# EAGLE design Servo_2016 (EAGLE 7.3.0)

## Sheet 1 of 4
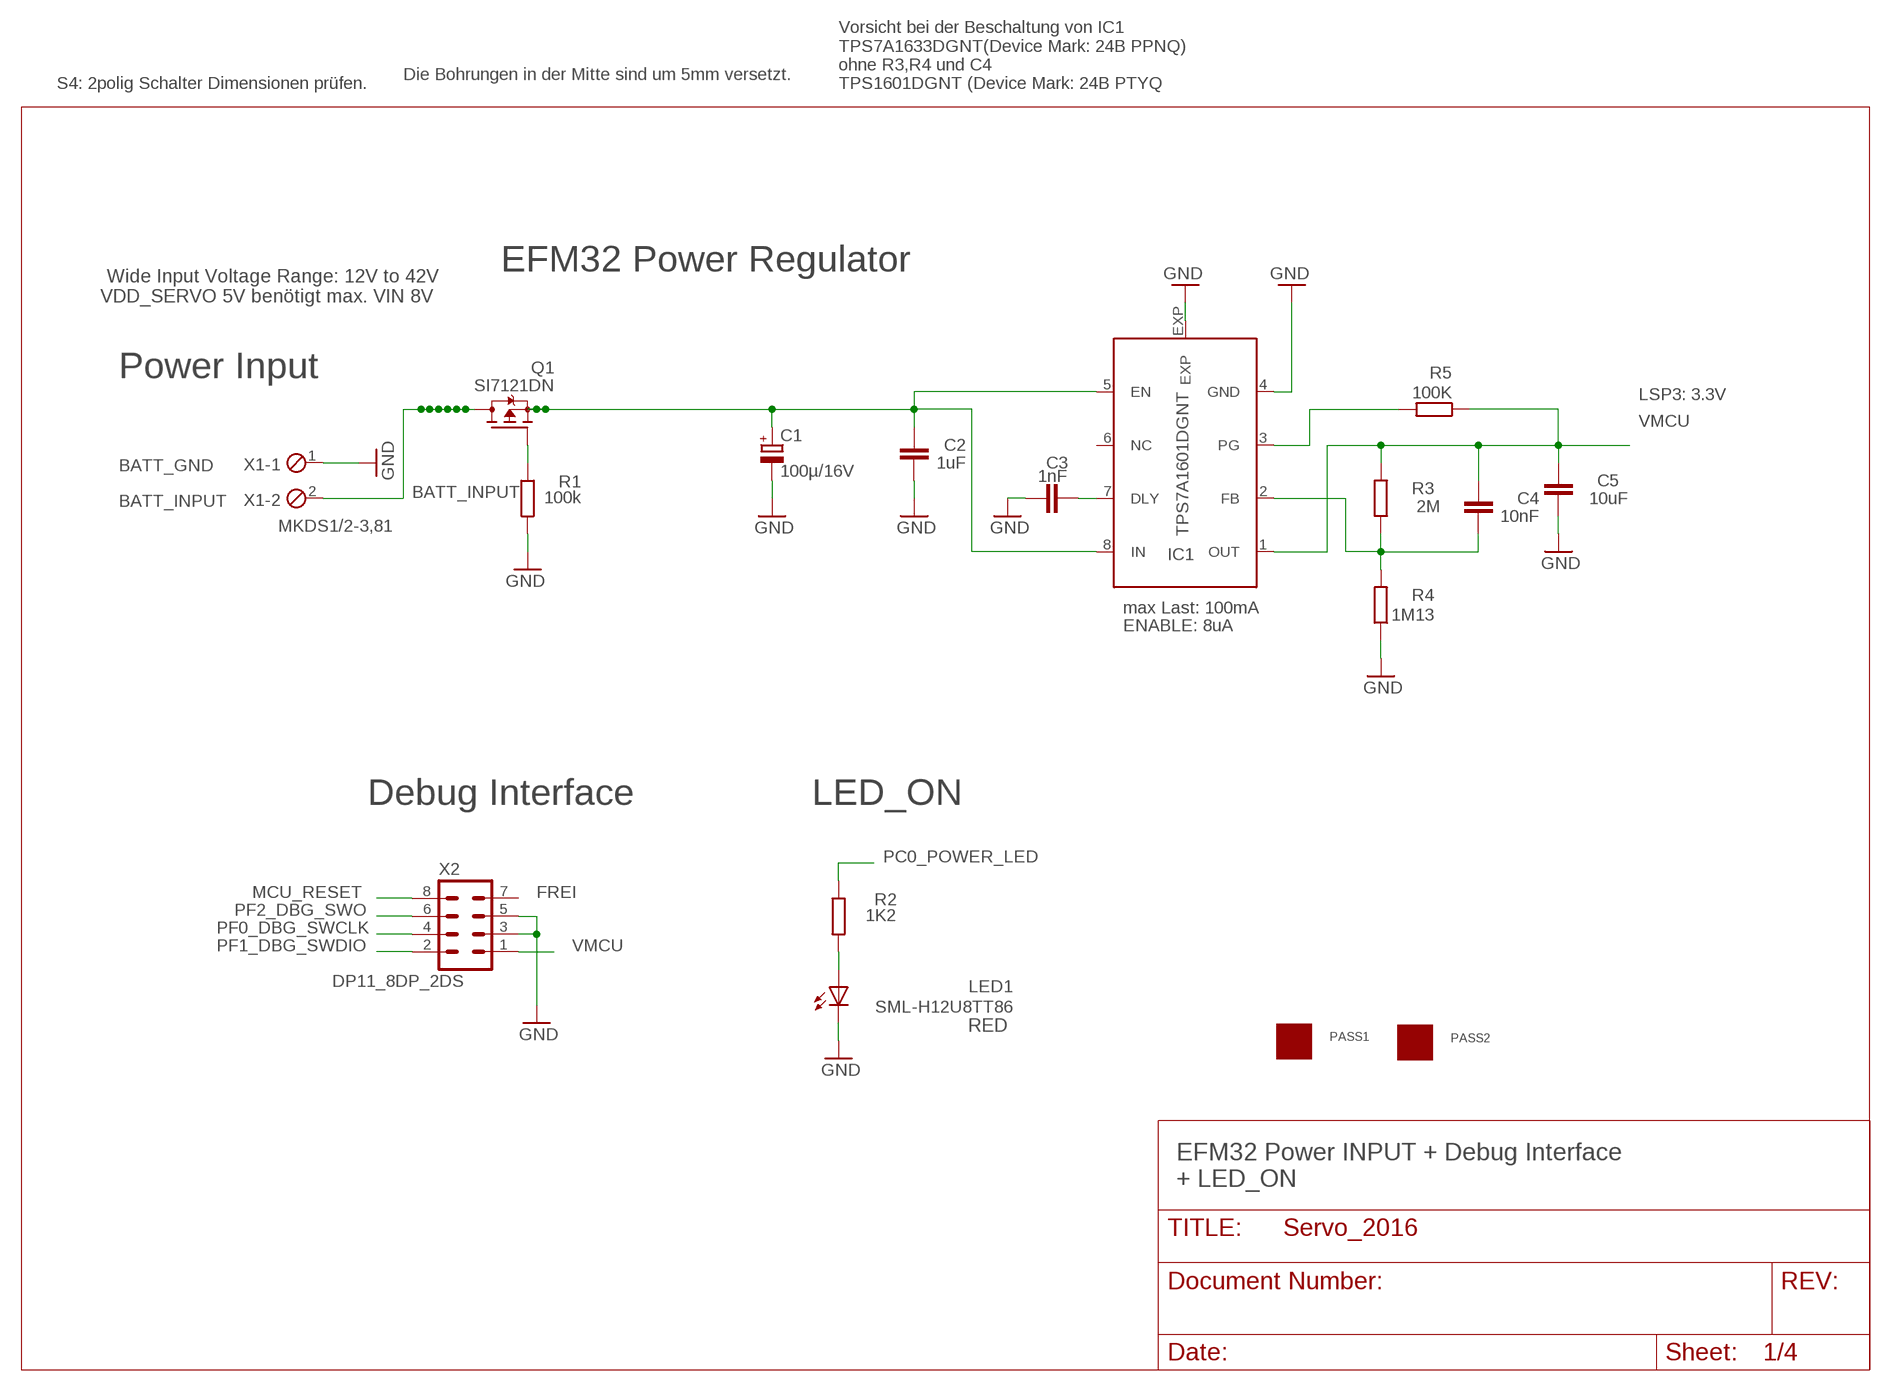
[diagram p0: schematic, sheet 1]

### Parts
C1  100µ/16V  CPOL-EUE  [PANASONIC_E]
C2  1uF  C-EUC0603  [C0603]
C3  1nF  C-EUC0603  [C0603]
C4  10nF  C-EUC0603  [C0603]
C5  10uF  C-EUC1206  [C1206]
IC1  TPS7A1601DGNT  TPS7A16  [DGN_S-PDSO-G8-EXP]
LED1  SML-H12U8TT86  LEDCHIPLED_0805  [CHIPLED_0805]
PASS1  ROUND_1MM1.5  [ROUND2_1.5MM]
PASS2  ROUND_1MM1.5  [ROUND2_1.5MM]
Q1  SI7121DN  TRANSISTOR-FET_SI7113DN  [TRANSISTOR-FET_1212-8S]
R1  100k  R-EU_R0805  [R0805]
R2  1K2  R-EU_R0805  [R0805]
R3  2M  R-EU_R0805  [R0805]
R4  1M13  R-EU_R0805  [R0805]
R5  100K  R-EU_R0805  [R0805]
X1  MKDS1/2-3,81  [2POL381]
X2  DP11_8DP_2DS  [DP11_8DP-2DS]

### Nets
BATT_INPUT: Q1.5(D) Q1.6(D) Q1.7(D) Q1.8(D) Q1.9(D) Q1.10(D) Q1.11(D) X1.2 ; also sheet 3
GND: C1.- C2.1 C3.1 C5.1 IC1.4(GND) IC1.EXP LED1.C R1.1 R4.1 X1.1 X2.3 X2.5 ; also sheet 2,3,4
MCU_RESET: X2.8 ; also sheet 2
N$4: C1.+ C2.2 IC1.5(EN) IC1.8(IN) Q1.1(S) Q1.2(S) Q1.3(S)
N$5: C3.2 IC1.7(DLY)
N$8: C4.1 IC1.2(FB) R3.1 R4.2
N$9: IC1.3(PG) R5.2
N$20: Q1.4(G) R1.2
N$29: LED1.A R2.2
PC0_POWER_LED: R2.1 ; also sheet 2
PF0_DBG_SWCLK: X2.4 ; also sheet 2
PF1_DBG_SWDIO: X2.2 ; also sheet 2
PF2_DBG_SWO: X2.6 ; also sheet 2
VMCU: C4.2 C5.2 IC1.1(OUT) R3.2 R5.1 X2.1 ; also sheet 2,4
Unconnected: IC1.6(NC) X2.7

### Notes on the sheet
- Die Bohrungen in der Mitte sind um 5mm versetzt.
- S4: 2polig Schalter Dimensionen prüfen.
- Vorsicht bei der Beschaltung von IC1 
  TPS7A1633DGNT(Device Mark: 24B PPNQ)
  ohne R3,R4 und C4
  TPS1601DGNT (Device Mark: 24B PTYQ
- EFM32 Power Regulator
- Wide Input Voltage Range: 12V to 42V
  VDD_SERVO 5V benötigt max. VIN 8V
- Power Input
- LSP3: 3.3V
- BATT_GND
- BATT_INPUT
- max Last: 100mA
- ENABLE: 8uA
- Debug Interface | LED_ON
- FREI
- RED
- EFM32 Power INPUT + Debug Interface
  + LED_ON

## Sheet 2 of 4
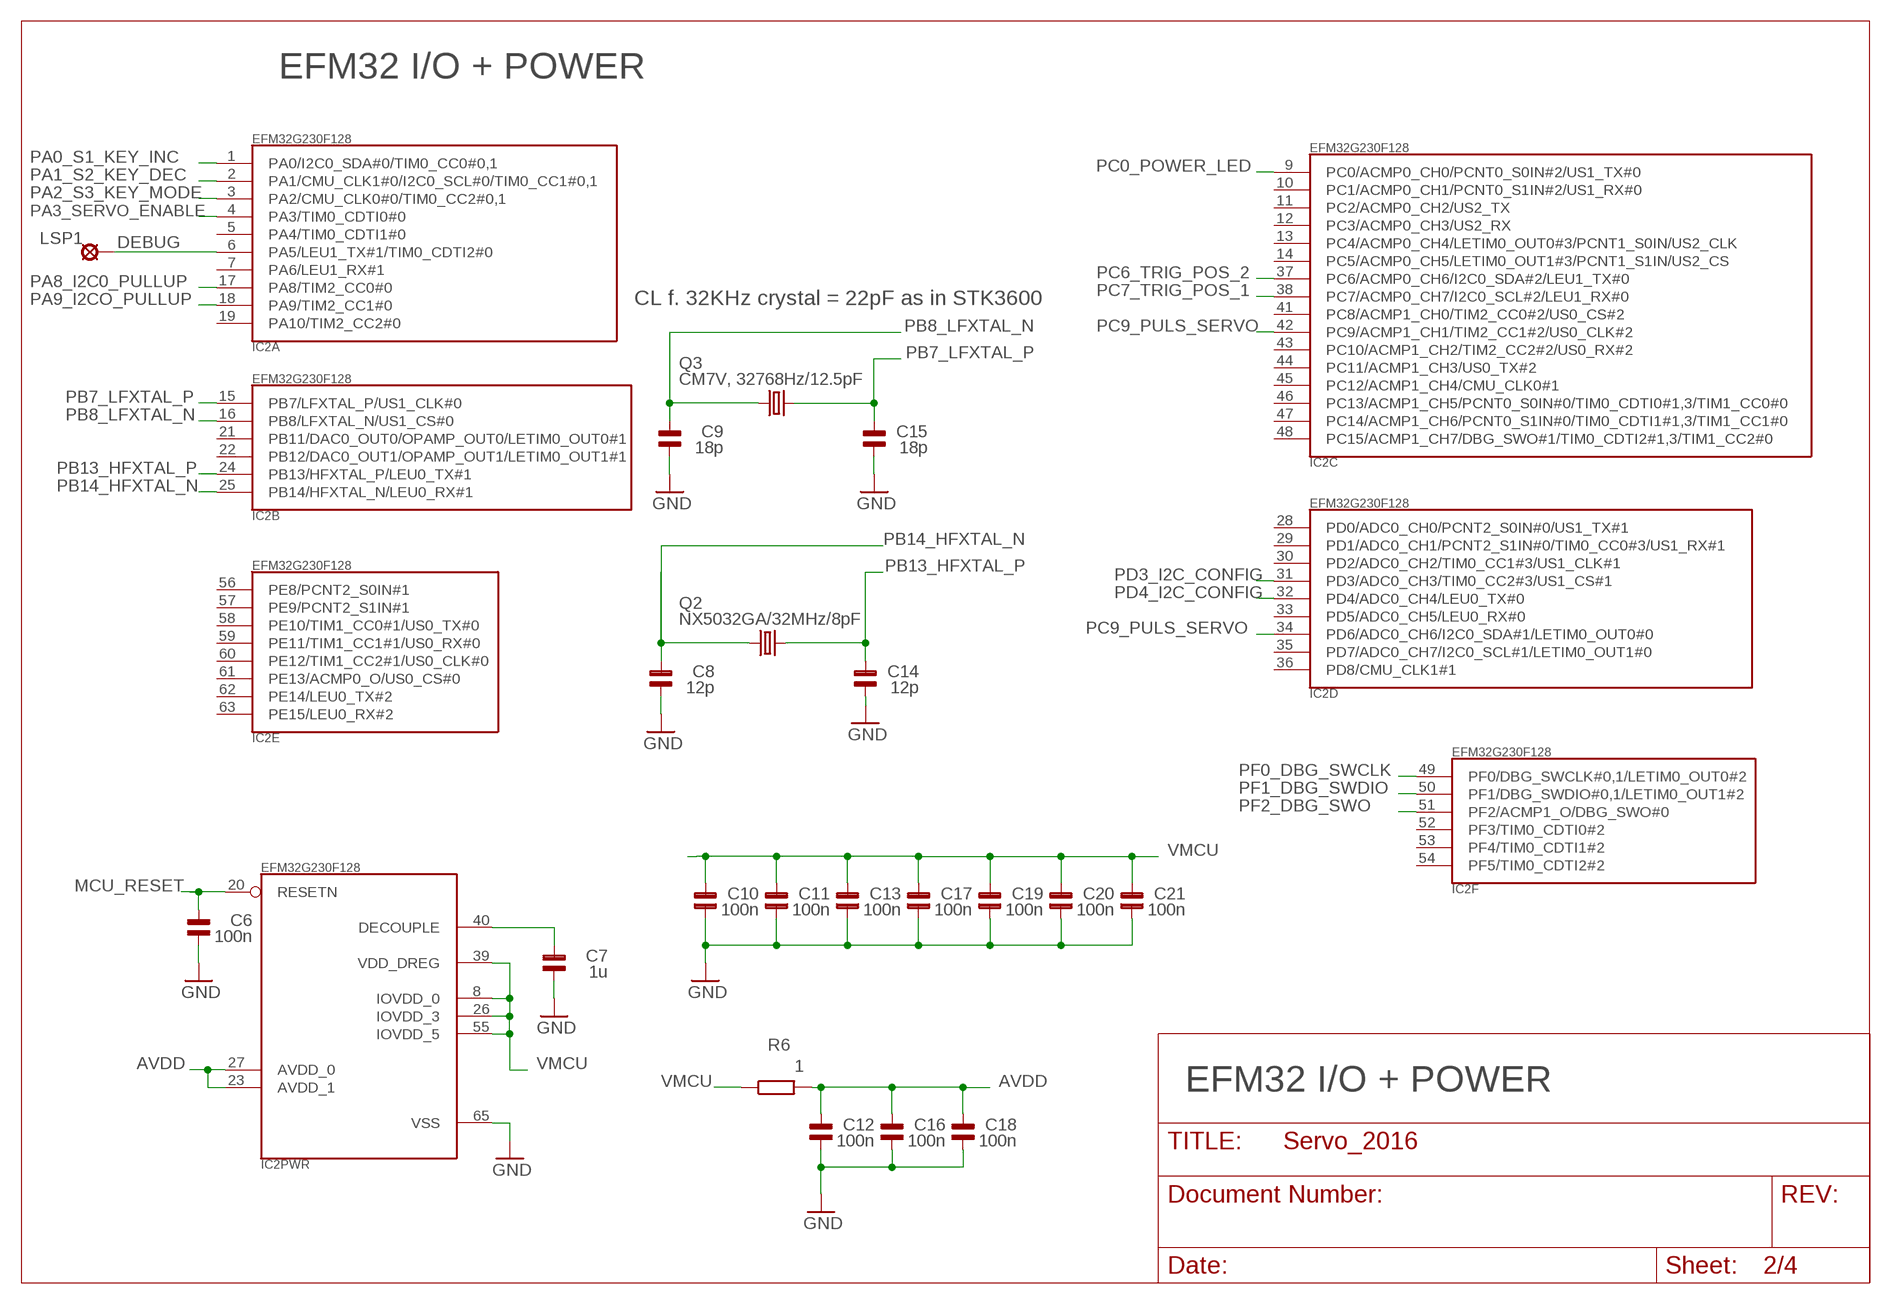
[diagram p1: schematic, sheet 2]

### Parts
C6  100n  C_SMD0805  [0805]
C7  1u  C_SMD0805  [0805]
C8  12p  C_SMD0805  [0805]
C9  18p  C_SMD0805  [0805]
C10  100n  C_SMD0805  [0805]
C11  100n  C_SMD0805  [0805]
C12  100n  C_SMD0805  [0805]
C13  100n  C_SMD0805  [0805]
C14  12p  C_SMD0805  [0805]
C15  18p  C_SMD0805  [0805]
C16  100n  C_SMD0805  [0805]
C17  100n  C_SMD0805  [0805]
C18  100n  C_SMD0805  [0805]
C19  100n  C_SMD0805  [0805]
C20  100n  C_SMD0805  [0805]
C21  100n  C_SMD0805  [0805]
IC2  EFM32G230F128  [QFN64]
LSP1  (n.b.)LSP10  LSP10  [LSP10]
Q2  NX5032GA/32MHz/8pF  CRYSTAL2P5.0X3.2  [CRYSTAL2P5.0X3.2]
Q3  CM7V, 32768Hz/12.5pF  CRYSTAL2P  [CRYSTAL2P3.2X1.5]
R6  1  R-EU_R0805  [R0805]

### Nets
AVDD [VCC]: C12.2 C16.2 C18.2 IC2.23(PWR:AVDD_1) IC2.27(PWR:AVDD_0) R6.2
DEBUG: IC2.6(A:PA5/LEU1_TX#1/TIM0_CDTI2#0) LSP1.MP
GND: C6.1 C7.1 C8.1 C9.1 C10.1 C11.1 C12.1 C13.1 C14.1 C15.1 C16.1 C17.1 C18.1 C19.1 C20.1 C21.1 IC2.65(PWR:VSS) ; also sheet 1,3,4
MCU_RESET: C6.2 IC2.20(PWR:RESETN) ; also sheet 1
N$30: C7.2 IC2.40(PWR:DECOUPLE)
PA0_S1_KEY_INC: IC2.1(A:PA0/I2C0_SDA#0/TIM0_CC0#0,1) ; also sheet 4
PA1_S2_KEY_DEC: IC2.2(A:PA1/CMU_CLK1#0/I2C0_SCL#0/TIM0_CC1#0,1) ; also sheet 4
PA2_S3_KEY_MODE: IC2.3(A:PA2/CMU_CLK0#0/TIM0_CC2#0,1) ; also sheet 4
PA3_SERVO_ENABLE: IC2.4(A:PA3/TIM0_CDTI0#0) ; also sheet 3
PA8_I2C0_PULLUP: IC2.17(A:PA8/TIM2_CC0#0) ; also sheet 4
PA9_I2CO_PULLUP: IC2.18(A:PA9/TIM2_CC1#0) ; also sheet 4
PB7_LFXTAL_P: C15.2 IC2.15(B:PB7/LFXTAL_P/US1_CLK#0) Q3.2
PB8_LFXTAL_N: C9.2 IC2.16(B:PB8/LFXTAL_N/US1_CS#0) Q3.1
PB13_HFXTAL_P: C14.2 IC2.24(B:PB13/HFXTAL_P/LEU0_TX#1) Q2.2
PB14_HFXTAL_N: C8.2 IC2.25(B:PB14/HFXTAL_N/LEU0_RX#1) Q2.1
PC0_POWER_LED: IC2.9(C:PC0/ACMP0_CH0/PCNT0_S0IN#2/US1_TX#0) ; also sheet 1
PC6_TRIG_POS_2: IC2.37(C:PC6/ACMP0_CH6/I2C0_SDA#2/LEU1_TX#0) ; also sheet 4
PC7_TRIG_POS_1: IC2.38(C:PC7/ACMP0_CH7/I2C0_SCL#2/LEU1_RX#0) ; also sheet 4
PC9_PULS_SERVO: IC2.34(D:PD6/ADC0_CH6/I2C0_SDA#1/LETIM0_OUT0#0) IC2.42(C:PC9/ACMP1_CH1/TIM2_CC1#2/US0_CLK#2) ; also sheet 4
PD3_I2C_CONFIG: IC2.31(D:PD3/ADC0_CH3/TIM0_CC2#3/US1_CS#1) ; also sheet 4
PD4_I2C_CONFIG: IC2.32(D:PD4/ADC0_CH4/LEU0_TX#0) ; also sheet 4
PF0_DBG_SWCLK: IC2.49(F:PF0/DBG_SWCLK#0,1/LETIM0_OUT0#2) ; also sheet 1
PF1_DBG_SWDIO: IC2.50(F:PF1/DBG_SWDIO#0,1/LETIM0_OUT1#2) ; also sheet 1
PF2_DBG_SWO: IC2.51(F:PF2/ACMP1_O/DBG_SWO#0) ; also sheet 1
VMCU: C10.2 C11.2 C13.2 C17.2 C19.2 C20.2 C21.2 IC2.8(PWR:IOVDD_0) IC2.26(PWR:IOVDD_3) IC2.39(PWR:VDD_DREG) IC2.55(PWR:IOVDD_5) R6.1 ; also sheet 1,4
Unconnected: IC2.5(A:PA4/TIM0_CDTI1#0) IC2.7(A:PA6/LEU1_RX#1) IC2.10(C:PC1/ACMP0_CH1/PCNT0_S1IN#2/US1_RX#0) IC2.11(C:PC2/ACMP0_CH2/US2_TX) IC2.12(C:PC3/ACMP0_CH3/US2_RX) IC2.13(C:PC4/ACMP0_CH4/LETIM0_OUT0#3/PCNT1_S0IN/US2_CLK) IC2.14(C:PC5/ACMP0_CH5/LETIM0_OUT1#3/PCNT1_S1IN/US2_CS) IC2.19(A:PA10/TIM2_CC2#0) IC2.21(B:PB11/DAC0_OUT0/OPAMP_OUT0/LETIM0_OUT0#1) IC2.22(B:PB12/DAC0_OUT1/OPAMP_OUT1/LETIM0_OUT1#1) IC2.28(D:PD0/ADC0_CH0/PCNT2_S0IN#0/US1_TX#1) IC2.29(D:PD1/ADC0_CH1/PCNT2_S1IN#0/TIM0_CC0#3/US1_RX#1) IC2.30(D:PD2/ADC0_CH2/TIM0_CC1#3/US1_CLK#1) IC2.33(D:PD5/ADC0_CH5/LEU0_RX#0) IC2.35(D:PD7/ADC0_CH7/I2C0_SCL#1/LETIM0_OUT1#0) IC2.36(D:PD8/CMU_CLK1#1) IC2.41(C:PC8/ACMP1_CH0/TIM2_CC0#2/US0_CS#2) IC2.43(C:PC10/ACMP1_CH2/TIM2_CC2#2/US0_RX#2) IC2.44(C:PC11/ACMP1_CH3/US0_TX#2) IC2.45(C:PC12/ACMP1_CH4/CMU_CLK0#1) IC2.46(C:PC13/ACMP1_CH5/PCNT0_S0IN#0/TIM0_CDTI0#1,3/TIM1_CC0#0) IC2.47(C:PC14/ACMP1_CH6/PCNT0_S1IN#0/TIM0_CDTI1#1,3/TIM1_CC1#0) IC2.48(C:PC15/ACMP1_CH7/DBG_SWO#1/TIM0_CDTI2#1,3/TIM1_CC2#0) IC2.52(F:PF3/TIM0_CDTI0#2) IC2.53(F:PF4/TIM0_CDTI1#2) IC2.54(F:PF5/TIM0_CDTI2#2) IC2.56(E:PE8/PCNT2_S0IN#1) IC2.57(E:PE9/PCNT2_S1IN#1) IC2.58(E:PE10/TIM1_CC0#1/US0_TX#0) IC2.59(E:PE11/TIM1_CC1#1/US0_RX#0) IC2.60(E:PE12/TIM1_CC2#1/US0_CLK#0) IC2.61(E:PE13/ACMP0_O/US0_CS#0) IC2.62(E:PE14/LEU0_TX#2) IC2.63(E:PE15/LEU0_RX#2)

### Notes on the sheet
- EFM32 I/O + POWER
- CL f. 32KHz crystal = 22pF as in STK3600
- EFM32 I/O + POWER

## Sheet 3 of 4
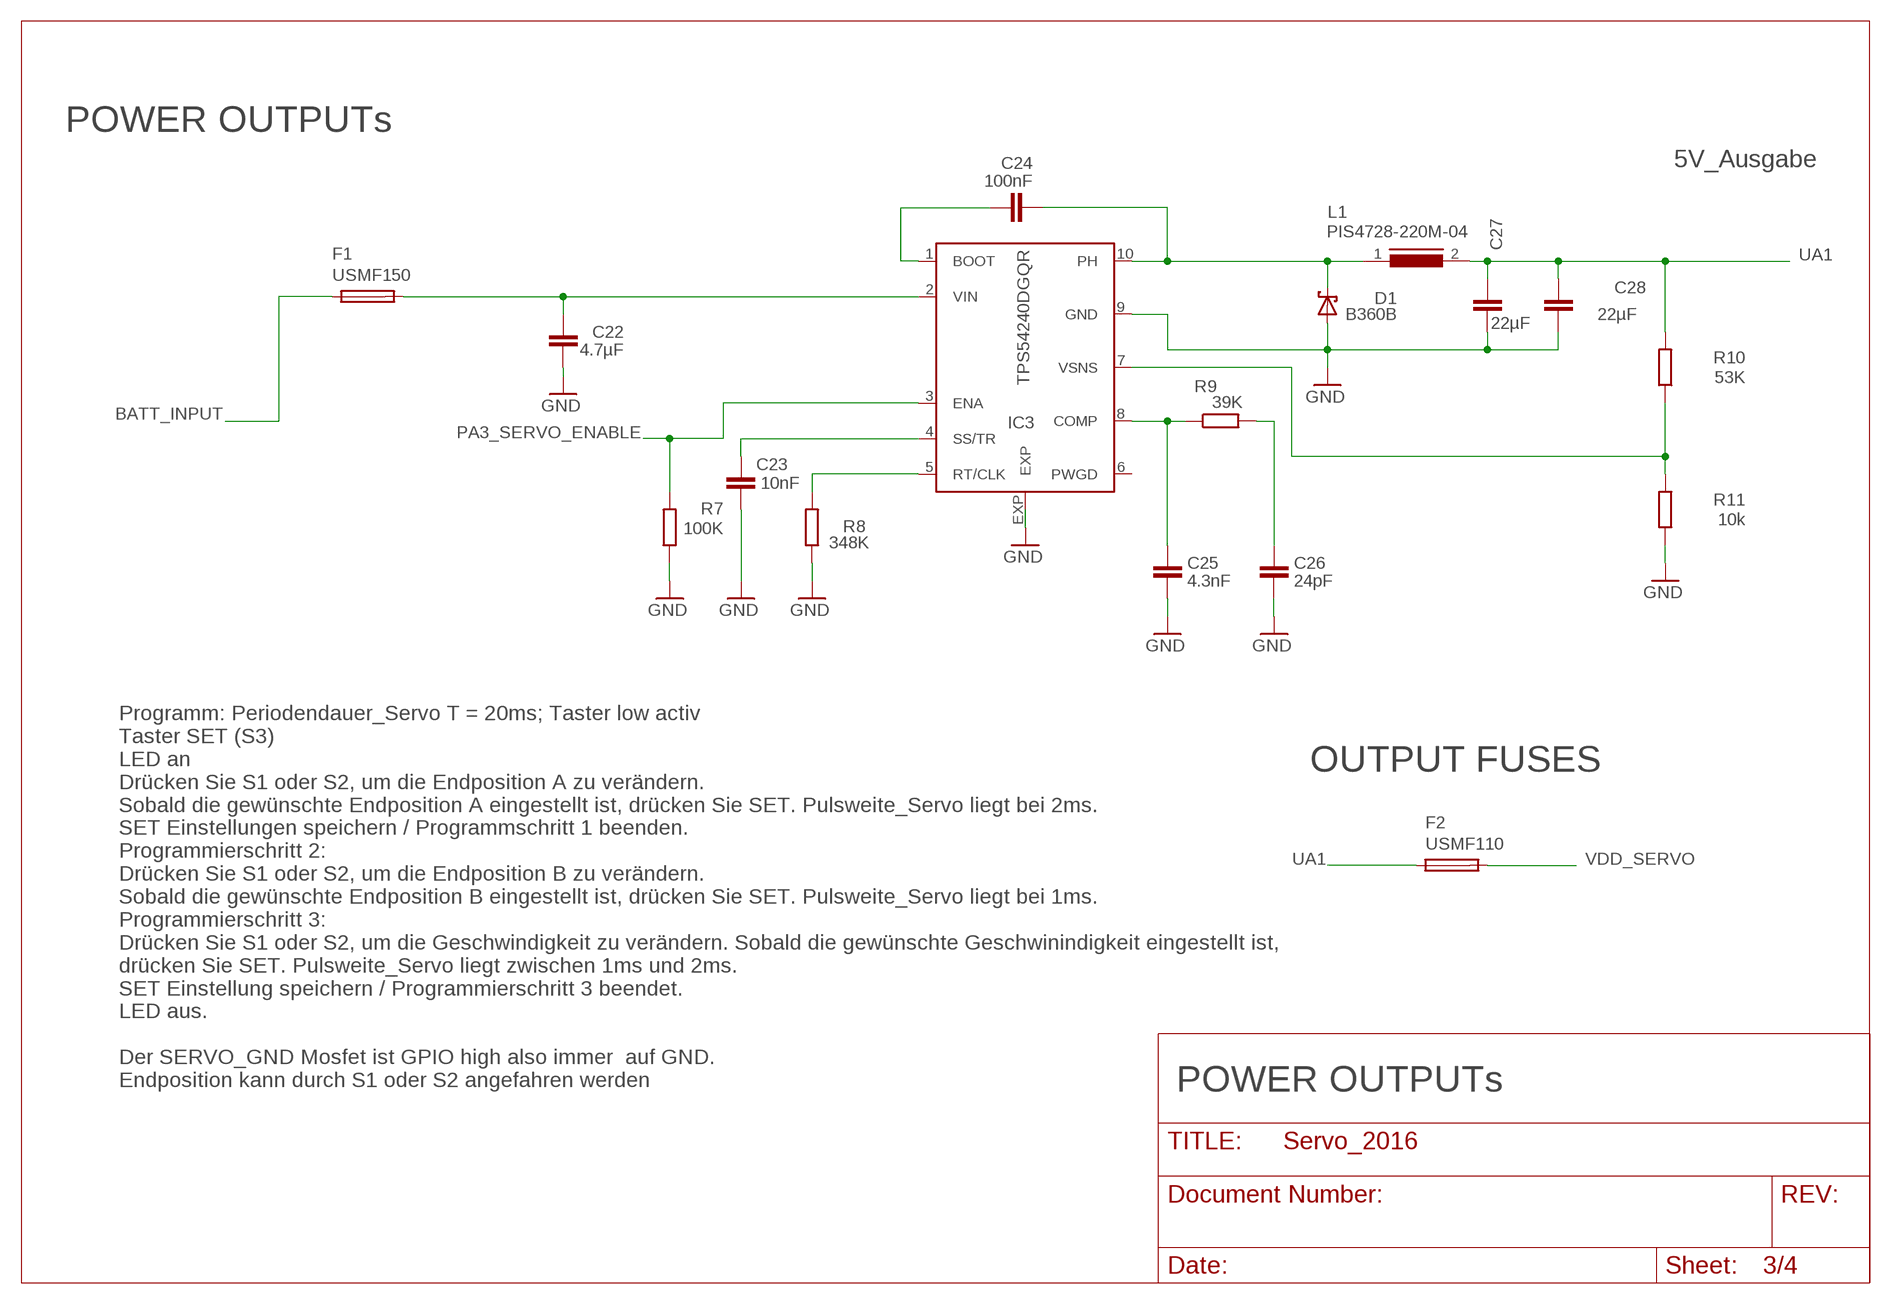
[diagram p2: schematic, sheet 3]

### Parts
C22  4.7µF  C-EUC1210  [C1210]
C23  10nF  C-EUC0603  [C0603]
C24  100nF  C-EUC0603  [C0603]
C25  4.3nF  C-EUC0603  [C0603]
C26  24pF  C-EUC0603  [C0603]
C27  22µF  C-EUC1210  [C1210]
C28  22µF  C-EUC1210  [C1210]
D1  B360B  SCHOTTKY-DIODESMD  [SMB]
F1  USMF150  PFUF  [PFUF_1210POLY]
F2  USMF110  PFUF  [PFUF_1210POLY]
IC3  TPS54240DGQR  [S-PDSO-G10]
L1  PIS4728-220M-04  DR127  [DR127]
R7  100K  R-EU_R0805  [R0805]
R8  348K  R-EU_R0805  [R0805]
R9  39K  R-EU_R0805  [R0805]
R10  53K  R-EU_R0805  [R0805]
R11  10k  R-EU_R0805  [R0805]

### Nets
BATT_INPUT: F1.P$1 ; also sheet 1
GND: C22.2 C23.2 C25.2 C26.2 C27.2 C28.2 D1.A IC3.9(GND) IC3.EXP R7.1 R8.1 R11.1 ; also sheet 1,2,4
N$1: IC3.5(RT/CLK) R8.2
N$19: C24.2 IC3.1(BOOT)
N$26: C24.1 D1.C IC3.10(PH) L1.1
N$27: C23.1 IC3.4(SS/TR)
N$28: C25.1 IC3.8(COMP) R9.1
N$31: C26.1 R9.2
N$32: IC3.7(VSNS) R10.1 R11.2
N$71: C22.1 F1.P$2 IC3.2(VIN)
PA3_SERVO_ENABLE: IC3.3(ENA) R7.2 ; also sheet 2
UA1: C27.1 C28.1 F2.P$1 L1.2 R10.2
VDD_SERVO: F2.P$2 ; also sheet 4
Unconnected: IC3.6(PWGD)

### Notes on the sheet
- POWER OUTPUTs
- 5V_Ausgabe
- OUTPUT FUSES
- Programm: Periodendauer_Servo T = 20ms; Taster low activ
  Taster SET (S3)
  LED an
  Drücken Sie S1 oder S2, um die Endposition A zu verändern.
  Sobald die gewünschte Endposition A eingestellt ist, drücken Sie SET. Pulsweite_Servo liegt bei 2ms.
  SET Einstellungen speichern / Programmschritt 1 beenden.
  Programmierschritt 2:
  Drücken Sie S1 oder S2, um die Endposition B zu verändern.
  Sobald die gewünschte Endposition B eingestellt ist, drücken Sie SET. Pulsweite_Servo liegt bei 1ms. 
  Programmierschritt 3:
  Drücken Sie S1 oder S2, um die Geschwindigkeit zu verändern. Sobald die gewünschte Geschwinindigkeit eingestellt ist,
  drücken Sie SET. Pulsweite_Servo liegt zwischen 1ms und 2ms.
  SET Einstellung speichern / Programmierschritt 3 beendet.
  LED aus. 
  
  Der SERVO_GND Mosfet ist GPIO high also immer  auf GND.
  Endposition kann durch S1 oder S2 angefahren werden
- POWER OUTPUTs

## Sheet 4 of 4
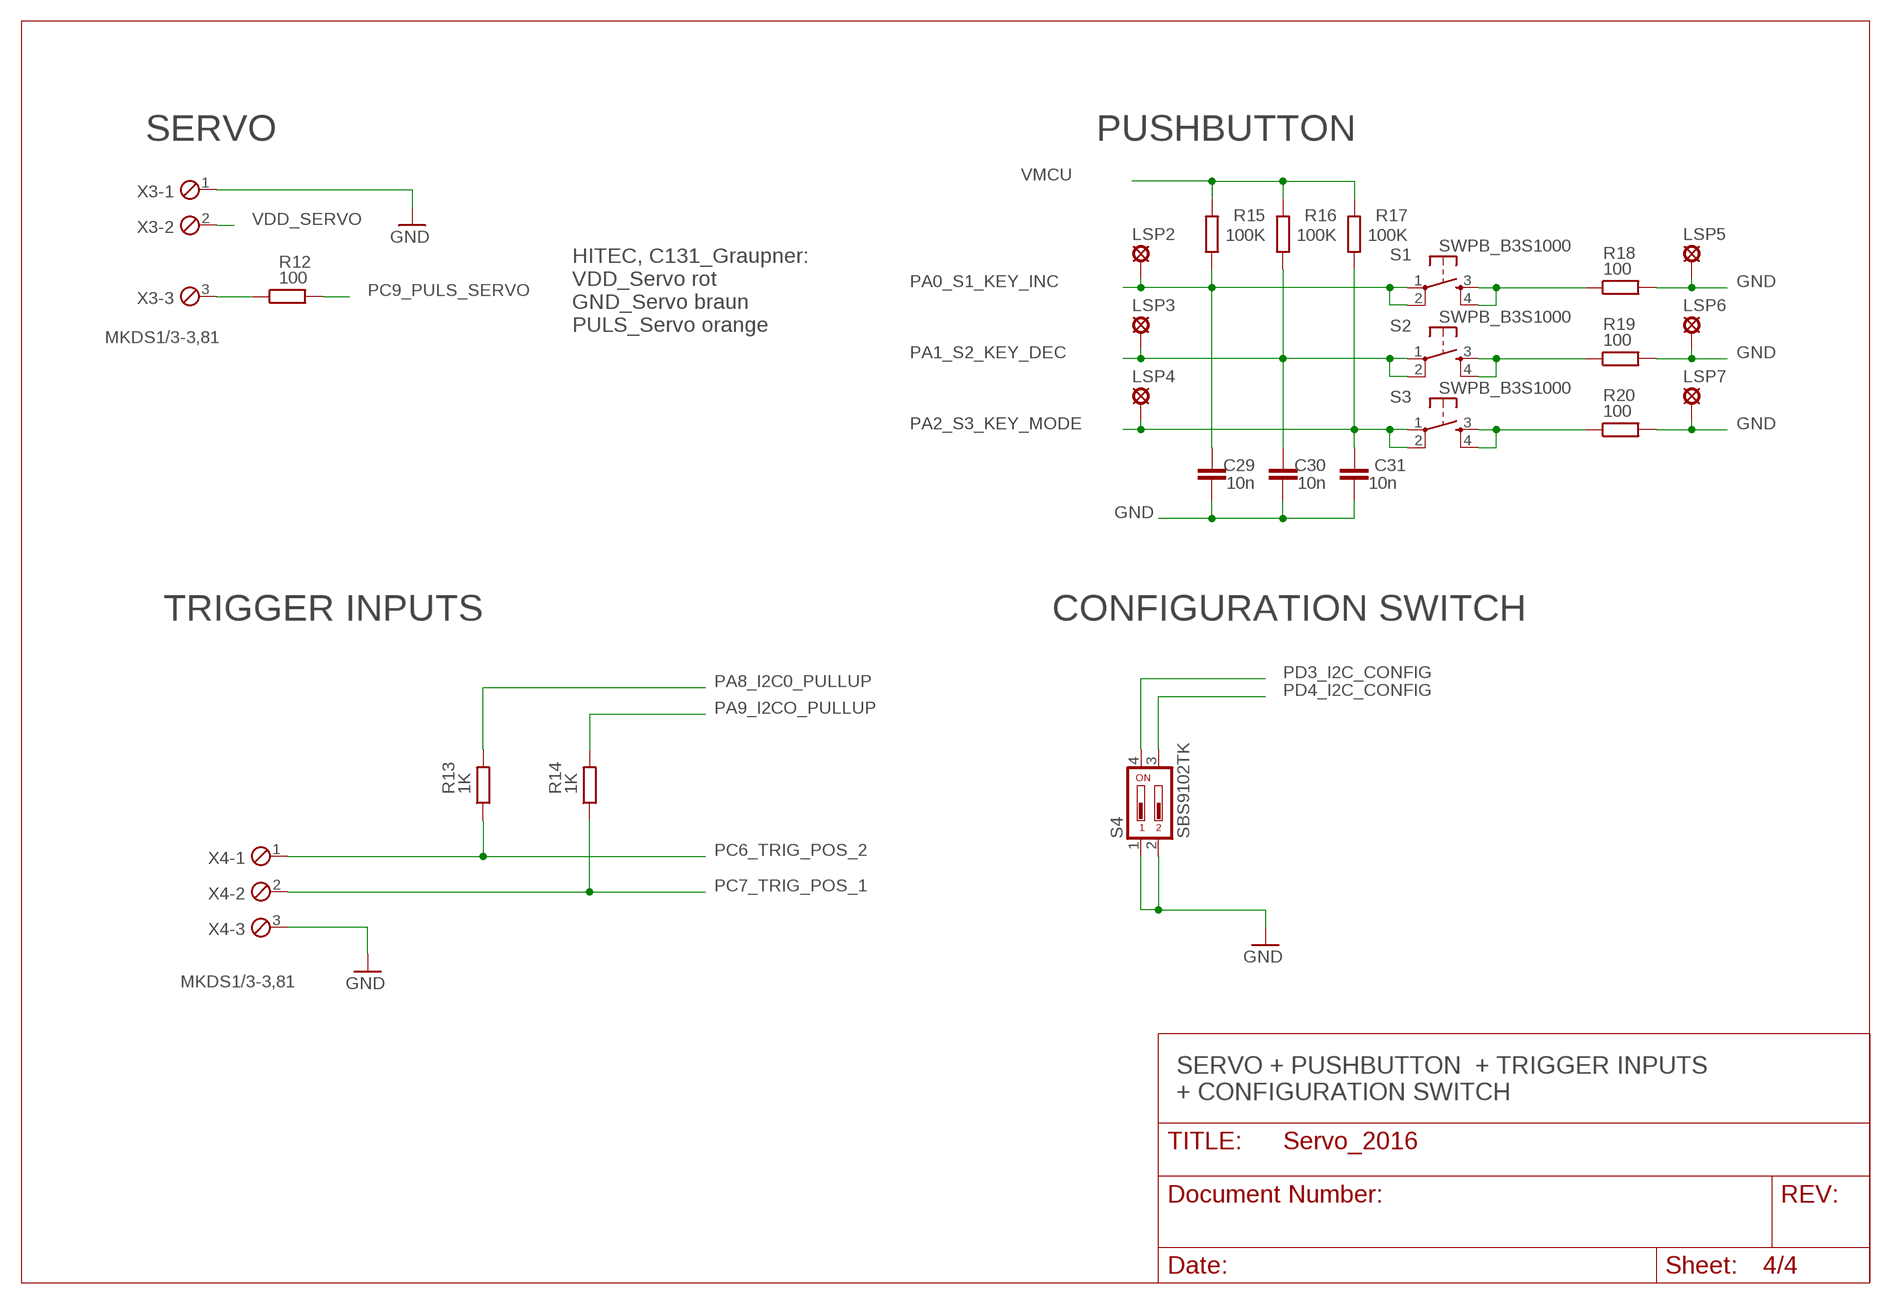
[diagram p3: schematic, sheet 4]

### Parts
C29  10n  C-EUC0603  [C0603]
C30  10n  C-EUC0603  [C0603]
C31  10n  C-EUC0603  [C0603]
LSP2  (n.b.)LSP10  LSP10  [LSP10]
LSP3  (n.b.)LSP10  LSP10  [LSP10]
LSP4  (n.b.)LSP10  LSP10  [LSP10]
LSP5  (n.b.)LSP10  LSP10  [LSP10]
LSP6  (n.b.)LSP10  LSP10  [LSP10]
LSP7  (n.b.)LSP10  LSP10  [LSP10]
R12  100  R-EU_R0805  [R0805]
R13  1K  R-EU_R0805  [R0805]
R14  1K  R-EU_R0805  [R0805]
R15  100K  R-EU_R0805  [R0805]
R16  100K  R-EU_R0805  [R0805]
R17  100K  R-EU_R0805  [R0805]
R18  100  R-EU_R0805  [R0805]
R19  100  R-EU_R0805  [R0805]
R20  100  R-EU_R0805  [R0805]
S1  SWPB_B3S1000  DTSM-6  [DTSM-6]
S2  SWPB_B3S1000  DTSM-6  [DTSM-6]
S3  SWPB_B3S1000  DTSM-6  [DTSM-6]
S4  SBS9102TK  219-02  [CTS-219-02]
X3  MKDS1/3-3,81  [3POL381]
X4  MKDS1/3-3,81  [3POL381]

### Nets
GND: C29.1 C30.1 C31.1 LSP5.MP LSP6.MP LSP7.MP R18.2 R19.2 R20.2 S4.1 S4.2 X3.1 X4.3 ; also sheet 1,2,3
N$10: R12.1 X3.3
N$15: R20.1 S3.3 S3.4
N$23: R18.1 S1.3 S1.4
N$24: R19.1 S2.3 S2.4
PA0_S1_KEY_INC: C29.2 LSP2.MP R15.1 S1.1 S1.2 ; also sheet 2
PA1_S2_KEY_DEC: C30.2 LSP3.MP R16.1 S2.1 S2.2 ; also sheet 2
PA2_S3_KEY_MODE: C31.2 LSP4.MP R17.1 S3.1 S3.2 ; also sheet 2
PA8_I2C0_PULLUP: R13.2 ; also sheet 2
PA9_I2CO_PULLUP: R14.2 ; also sheet 2
PC6_TRIG_POS_2: R13.1 X4.1 ; also sheet 2
PC7_TRIG_POS_1: R14.1 X4.2 ; also sheet 2
PC9_PULS_SERVO: R12.2 ; also sheet 2
PD3_I2C_CONFIG: S4.4 ; also sheet 2
PD4_I2C_CONFIG: S4.3 ; also sheet 2
VDD_SERVO: X3.2 ; also sheet 3
VMCU: R15.2 R16.2 R17.2 ; also sheet 1,2

### Notes on the sheet
- SERVO | PUSHBUTTON
- HITEC, C131_Graupner:
  VDD_Servo rot
  GND_Servo braun
  PULS_Servo orange
- TRIGGER INPUTS | CONFIGURATION SWITCH
- SERVO + PUSHBUTTON  + TRIGGER INPUTS
  + CONFIGURATION SWITCH

## Library data of the parts
C1 = rcl:CPOL-EU: POLARIZED CAPACITOR, European symbol
C2-C5 C29-C31 = resistor:C-EU: CAPACITOR, European symbol
C6-C21 = IAR.RLC:C_SMD
C22-C28 = rcl:C-EU: CAPACITOR, European symbol
D1 = diode:SCHOTTKY-DIODE: Schottky Diode
F1 F2 = fuse:PFUF
IC1 = texas_Kiermaier:TPS7A16
IC2 = EnergyMicro:EFM32G230F128: EFM32G230F128 Gecko Microcontroller in 9mm x 9mm QFN64 package
IC3 = texas:TPS54240DGQR
L1 = inductors:DR127: High Power Density, High Efficiency, Shielded Inductors Source: coiltronics_dr_series.pdf
LED1 = led:LED: LED OSRAM: - CHIPLED LG R971, LG N971, LY N971, LG Q971, LY Q971, LO R971, LY R971 LH N974, LH R974 LS Q976, LO Q976, LY Q976 LO Q996 - Hyper CHIPLED LW Q18S LB Q993, LB Q99A, LB R99A - SideLED LS A670, LO A670, LY A670, LG A670, LP A670 LB A673, LV A673, LT A673, LW A673 LH A674 LY A675 LS A676, LA A676, LO A676, LY A676, LW A676 LS A679, LY A679, LG A679 - Hyper Micro SIDELED® LS Y876, LA Y876, LO Y876, LY Y876 LT Y87S - SmartLED LW L88C, LW L88S LB L89C, LB L89S, LG L890 LS L89K, LO L89K, LY L89K LS L896, LA L896, LO L896, LY L896 - TOPLED LS T670, LO T670, LY T670, LG T670, LP T670 LSG T670, LSP T670, LSY T670, LOP T670, LYG T670 LG T671, LOG T671, LSG T671 LB T673, LV T673, LT T673, LW T673 LH T674 LS T676, LA T676, LO T676, LY T676, LB T676, LH T676, LSB T676, LW T676 LB T67C, LV T67C, LT T67C, LS T67K, LO T67K, LY T67K, LW E67C LS E67B, LA E67B, LO E67B, LY E67B, LB E67C, LV E67C, LT E67C LW T67C LS T679, LY T679, LG T679 LS T770, LO T770, LY T770, LG T770, LP T770 LB T773, LV T773, LT T773, LW T773 LH T774 LS E675, LA E675, LY E675, LS T675 LS T776, LA T776, LO T776, LY T776, LB T776 LHGB T686 LT T68C, LB T68C - Hyper Mini TOPLED® LB M676 - Mini TOPLED Santana® LG M470 LS M47K, LO M47K, LY M47K Source: http://www.osram.convergy.de LUXEON: - LUMILED® LXK2-PW12-R00, LXK2-PW12-S00, LXK2-PW14-U00, LXK2-PW14-V00 LXK2-PM12-R00, LXK2-PM12-S00, LXK2-PM14-U00 LXK2-PE12-Q00, LXK2-PE12-R00, LXK2-PE12-S00, LXK2-PE14-T00, LXK2-PE14-U00 LXK2-PB12-K00, LXK2-PB12-L00, LXK2-PB12-M00, LXK2-PB14-N00, LXK2-PB14-P00, LXK2-PB14-Q00 LXK2-PR12-L00, LXK2-PR12-M00, LXK2-PR14-Q00, LXK2-PR14-R00 LXK2-PD12-Q00, LXK2-PD12-R00, LXK2-PD12-S00 LXK2-PH12-R00, LXK2-PH12-S00 LXK2-PL12-P00, LXK2-PL12-Q00, LXK2-PL12-R00 Source: www.luxeon.com KINGBRIGHT: KA-3528ASYC Source: www.kingbright.com
LSP1-LSP7 = solpad:LSP10: SOLDER PAD drill 1.0 mm, distributor Buerklin, 12H555
PASS1 PASS2 = Passermarks:ROUND_1MM
Q1 = dcdc_BB3_V0:TRANSISTOR-FET_SI7113DN
Q2 Q3 = EdM 2011:CRYSTAL2P: Quarz Crystal
R1-R5 R7-R20 = resistor:R-EU_: RESISTOR, European symbol
R6 = rcl:R-EU_: RESISTOR, European symbol
S1-S3 = switch-tact:DTSM-6
S4 = switch-dil:219-02*: Surface Mount DIP Switch Series 219 SMT CTS Electronic Components Sourc: www.ctscorp.com; OC_FARNELL: unknown; OC_NEWARK: unknown
X1 = con-phoenix-381:MKDS1/2-3,81: MKDS 1/2-3,81 - Order No. 1727010 (RS-Online - 101-5384) Pitch: 3,81mm Number of terminals: 2 Rated Voltage: 160V Maximum load current/ cross section: 12A/1.5mm2-AWG16 Housing Interlocking: none Color: Green
X2 = con-hirose_1:DP11_8DP_2DS
X3 X4 = con-phoenix-381:MKDS1/3-3,81: MKDS 1/3-3,81 - Order No. 1727023 (RS-Online - 101-5390) Pitch: 3,81mm Number of terminals: 3 Rated Voltage: 160V Maximum load current/ cross section: 12A/1.5mm2-AWG16 Housing Interlocking: none Color: Green

## Net classes
0 default: width 0.15 mm
1 GND: width 0.2 mm
2 VCC: width 0.25 mm

## Board
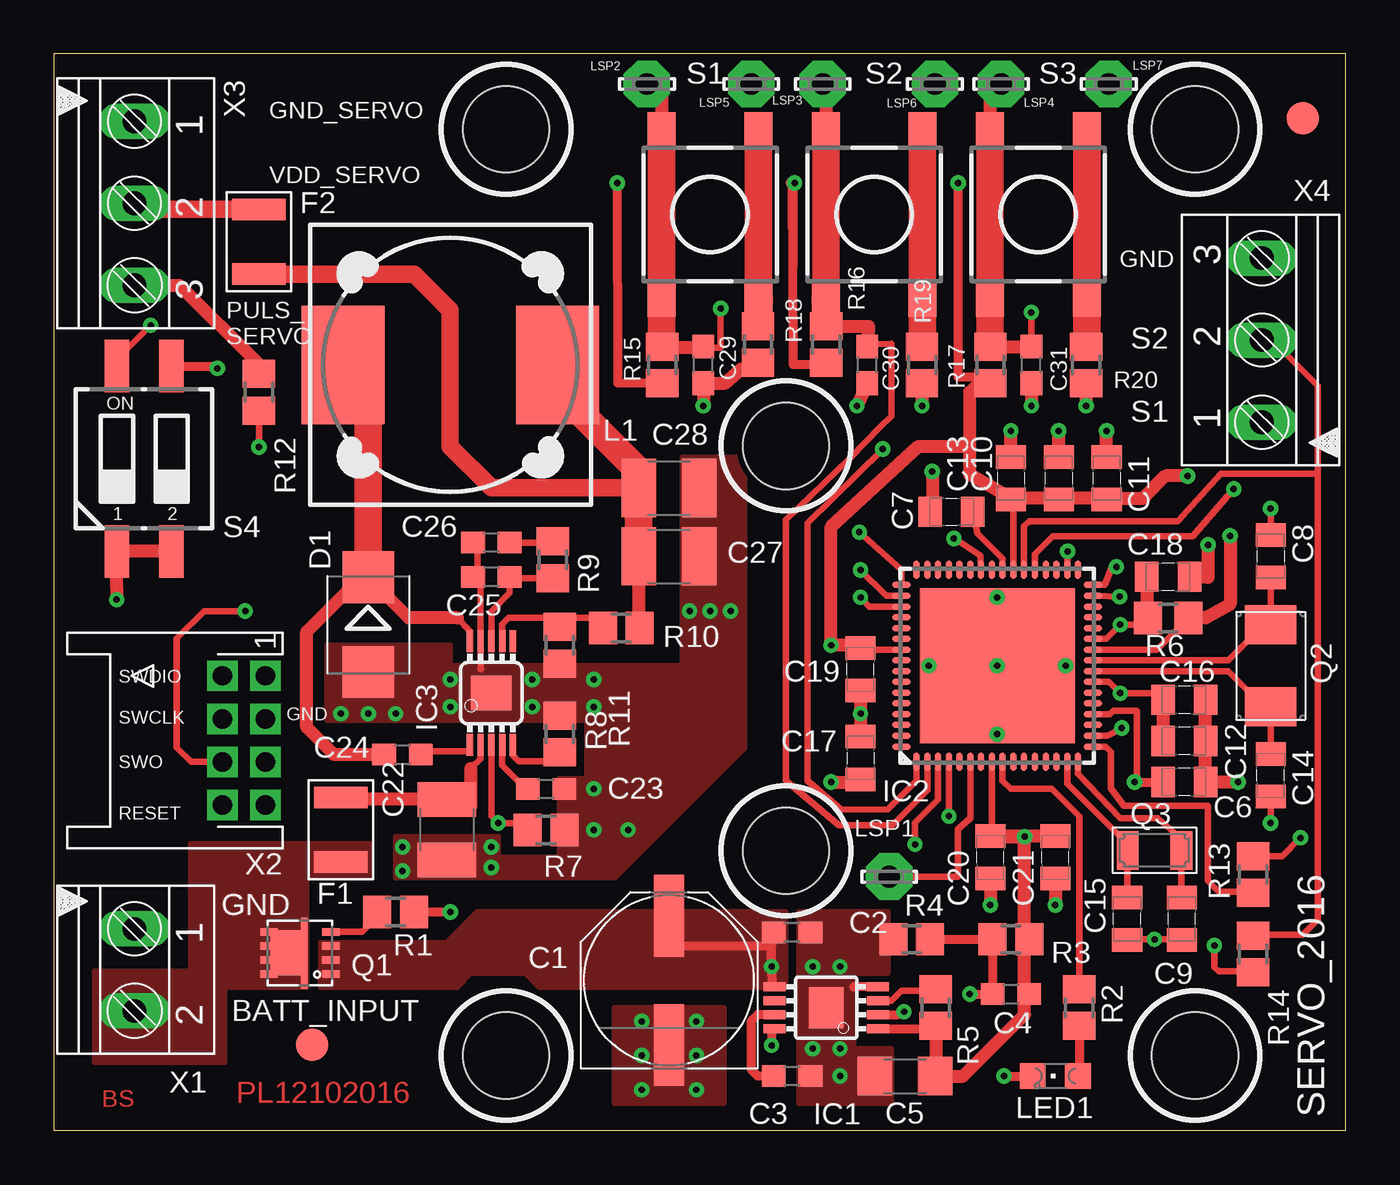
[diagram p4: board, top side]
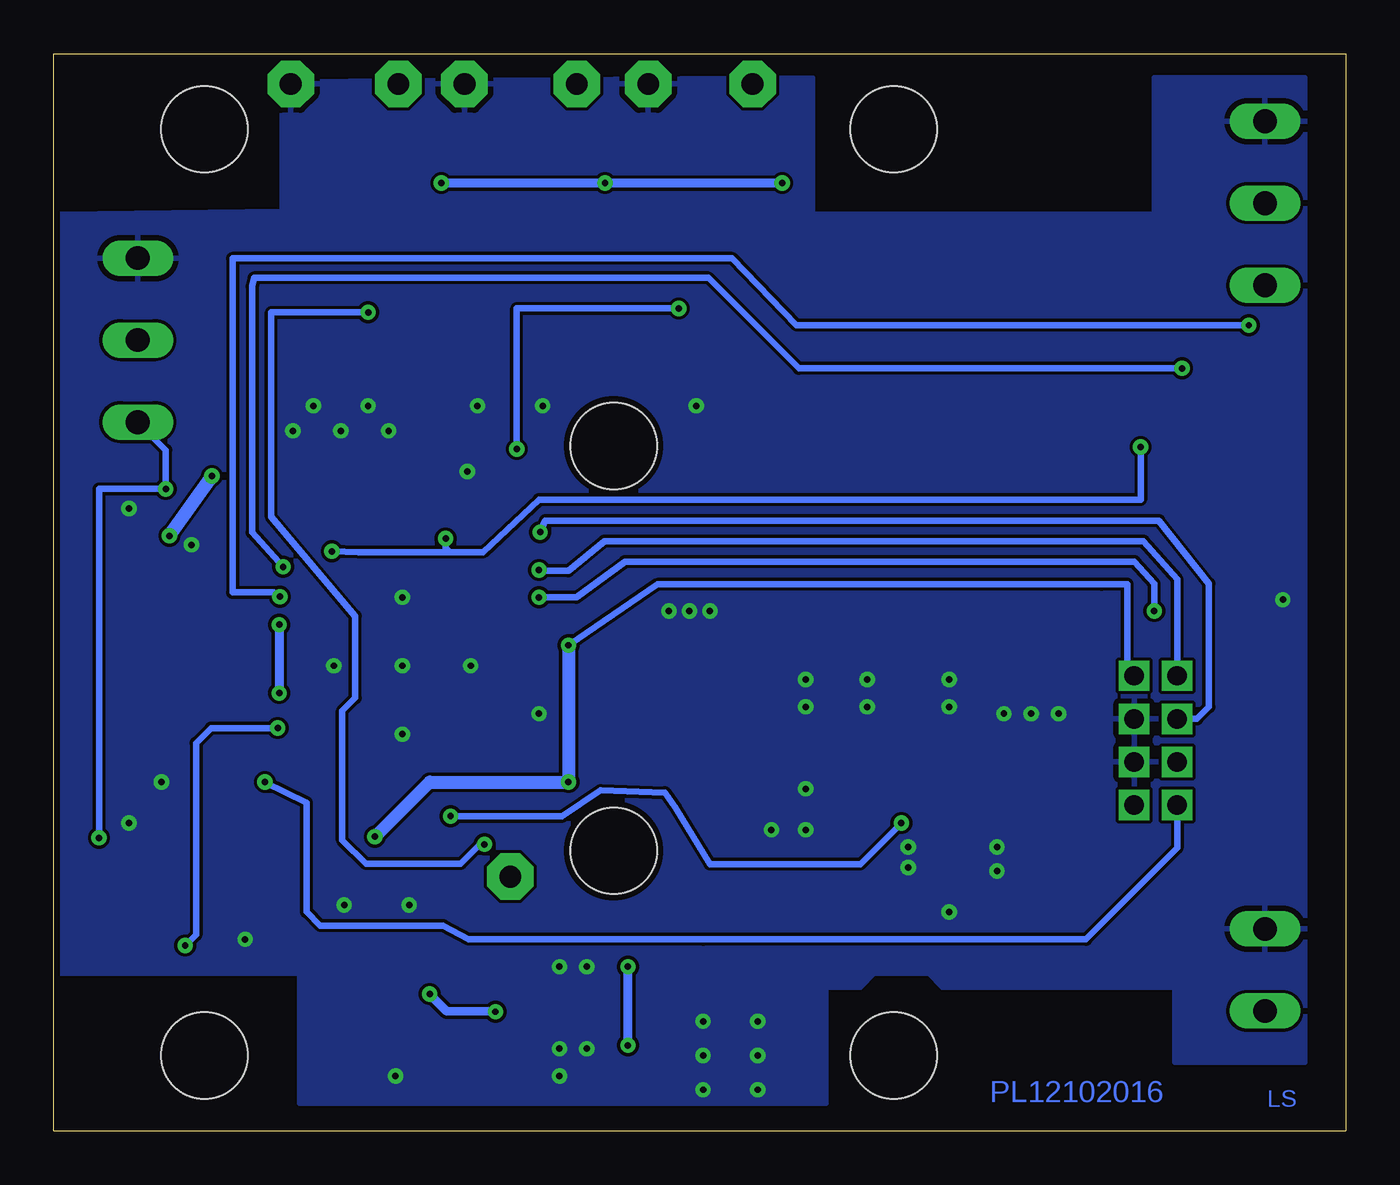
[diagram p5: board, bottom side, seen from below]

Size 60 x 50 mm. Coordinates in mm from the lower left corner, seen from the top.
Outline: 0,50 0,0 60,0 60,50 0,50
Copper layers (1*16): Top 0.035mm / dielectric 1.5mm / Bottom 0.035mm
Design rules "default *": minimum track width 10mil, minimum drill 11mil, track to track 6mil, track to pad 6mil, pad to pad 6mil, via to via 6mil, smd to smd 0mil, copper to edge 12mil, drill to drill 8mil, minimum pad ring 10mil, minimum via ring 8mil, stop-mask expansion 4mil, vias tented up to drill 0mil, thermal gap 10mil
Holes 4 mm at 21,46.5 53,3.5 21,3.5 53,46.5 34,13 34,31.8

### Footprints (pad centres in the part's own frame; a part is rotated, then mirrored left to right if it is on the bottom)
PANASONIC_E = smd 3.8 x 1.4: + 3,0; - -3,0
C0603 = smd 1.1 x 1: 1 -0.85,0; 2 0.85,0
C1206 = smd 1.6 x 1.8: 1 -1.4,0; 2 1.4,0
0805 = smd 1.092 x 1.397: 1 -0.991,0; 2 0.991,0
C1210 = smd 1.6 x 2.7: 1 -1.4,0; 2 1.4,0
SMB = smd 2.4 x 2.4: A 2.2,0; C -2.2,0
PFUF_1210POLY = smd 1 x 2.5: P$1 -1.5,0; P$2 1.5,0
DGN_S-PDSO-G8-EXP = smd 0.41 x 1.02: 1 -0.975,-2.4; 2 -0.325,-2.4; 3 0.325,-2.4; 4 0.975,-2.4; 5 0.975,2.4; 6 0.325,2.4; 7 -0.325,2.4; 8 -0.975,2.4 | smd 1.92 x 1.6: EXP 0,0
QFN64 = smd 0.85 x 0.3: 1 -4.45,3.75; 2 -4.45,3.25; 3 -4.45,2.75; 4 -4.45,2.25; 5 -4.45,1.75; 6 -4.45,1.25; 7 -4.45,0.75; 8 -4.45,0.25; 9 -4.45,-0.25; 10 -4.45,-0.75; 11 -4.45,-1.25; 12 -4.45,-1.75; 13 -4.45,-2.25; 14 -4.45,-2.75; 15 -4.45,-3.25; 16 -4.45,-3.75; 33 4.45,-3.75; 34 4.45,-3.25; 35 4.45,-2.75; 36 4.45,-2.25; 37 4.45,-1.75; 38 4.45,-1.25; 39 4.45,-0.75; 40 4.45,-0.25; 41 4.45,0.25; 42 4.45,0.75; 43 4.45,1.25; 44 4.45,1.75; 45 4.45,2.25; 46 4.45,2.75; 47 4.45,3.25; 48 4.45,3.75 | smd 0.3 x 0.85: 17 -3.75,-4.45; 18 -3.25,-4.45; 19 -2.75,-4.45; 20 -2.25,-4.45; 21 -1.75,-4.45; 22 -1.25,-4.45; 23 -0.75,-4.45; 24 -0.25,-4.45; 25 0.25,-4.45; 26 0.75,-4.45; 27 1.25,-4.45; 28 1.75,-4.45; 29 2.25,-4.45; 30 2.75,-4.45; 31 3.25,-4.45; 32 3.75,-4.45; 49 3.75,4.45; 50 3.25,4.45; 51 2.75,4.45; 52 2.25,4.45; 53 1.75,4.45; 54 1.25,4.45; 55 0.75,4.45; 56 0.25,4.45; 57 -0.25,4.45; 58 -0.75,4.45; 59 -1.25,4.45; 60 -1.75,4.45; 61 -2.25,4.45; 62 -2.75,4.45; 63 -3.25,4.45; 64 -3.75,4.45 | smd 7.2 x 7.2: 65 0,0
S-PDSO-G10 = smd 0.3 x 1.02: 1 -1,-2.4; 2 -0.5,-2.4; 3 0,-2.4; 4 0.5,-2.4; 5 1,-2.4; 6 1,2.4; 7 0.5,2.4; 8 0,2.4; 9 -0.5,2.4; 10 -1,2.4 | smd 1.9 x 1.6: EXP 0,0
DR127 = smd 3.85 x 5.5: 1 -4.975,0; 2 4.975,0
CHIPLED_0805 = smd 1.2 x 1.2: A 0,-1.05; C 0,1.05
LSP10 = drill 1.016 pad 2.159 octagon: MP 0,0
ROUND2_1.5MM = smd 1.5 x 1.5: FID 0,0
TRANSISTOR-FET_1212-8S = smd 0.8 x 0.34: 1 -1.435,0.97; 2 -1.435,0.325; 3 -1.435,-0.325; 4 -1.435,-0.975; 5 1.435,-0.975; 6 1.435,-0.325; 7 1.435,0.325; 8 1.435,0.975 | smd 0.3 x 0.8: 9 -0.2,-1.225; 10 -0.2,1.25 | smd 1.7 x 2.1: 11 0.5,-0.015
CRYSTAL2P5.0X3.2 = smd 1.8 x 2.4: 1 -1.9,0; 2 1.9,0
CRYSTAL2P3.2X1.5 = smd 1 x 1.8: 1 -1.25,0; 2 1.25,0
R0805 = smd 1.3 x 1.5: 1 -0.85,0; 2 0.85,0
R0805' = smd 1.3 x 1.5: 1 -0.95,0; 2 0.95,0
DTSM-6 = smd 1.55 x 1.3: 1 -3.975,2.25; 2 3.975,2.25; 3 -3.975,-2.25; 4 3.975,-2.25
CTS-219-02 = smd 1.13 x 2.44: 1 -1.27,-4.3; 2 1.27,-4.3; 3 1.27,4.3; 4 -1.27,4.3
2POL381 = drill 1.1 long: 1 0,0; 2 3.81,0
DP11_8DP-2DS = drill 0.9 square: 1 3,-9.2; 2 3,-7.2; 3 1,-9.2; 4 1,-7.2; 5 -1,-9.2; 6 -1,-7.2; 7 -3,-9.2; 8 -3,-7.2
3POL381 = drill 1.1 long: 1 0,0; 2 3.81,0; 3 7.62,0

### Placement (x,y rotation side)
C1  28.57,6.99 90 top
C2  34.29,9.21 180 top
C3  34.29,2.54 180 top
C4  44.45,6.35 0 top
C5  39.53,2.54 0 top
C6  52.5,16.19 180 top
C7  41.69,28.74 0 top
C8  56.52,26.67 270 top
C9  52.39,9.84 90 top
C10  46.67,30.3 270 top
C11  48.9,30.3 270 top
C12  52.5,18.1 180 top
C13  44.45,30.3 270 top
C14  56.52,16.51 90 top
C15  49.85,9.84 90 top
C16  52.5,20 180 top
C17  37.47,17.3 270 top
C18  51.75,25.72 180 top
C19  37.47,21.43 90 top
C20  43.5,12.7 90 top
C21  46.51,12.7 90 top
C22  18.26,13.97 270 top
C23  22.86,15.88 0 top
C24  16.19,17.46 0 top
C25  20.32,25.72 180 top
C26  20.32,27.3 180 top
C27  28.57,26.67 0 top
C28  28.57,29.84 0 top
C29  30.16,35.56 90 top
C30  37.78,35.56 90 top
C31  45.4,35.56 90 top
D1  14.61,23.5 270 top
F1  13.34,13.97 90 top
F2  9.53,41.27 90 top
IC1  35.88,5.71 90 top
IC2  43.81,21.59 90 top
IC3  20.32,20.32 0 top
L1  18.41,35.56 0 top
LED1  46.51,2.54 90 top
LSP1  38.8,11.8 0 top
LSP2  27.55,48.6 0 top
LSP3  35.71,48.6 0 top
LSP4  44,48.6 0 top
LSP5  32.39,48.6 0 top
LSP6  40.93,48.6 0 top
LSP7  49,48.6 0 top
PASS1  12,4 0 top
PASS2  58,47 0 top
Q1  11.43,8.26 180 top
Q2  56.52,21.59 270 top
Q3  51.12,13.02 180 top
R1  15.88,10.16 180 top
R2  47.62,5.71 270 top
R3  44.45,8.89 0 top
R4  39.85,8.89 0 top
R5  40.96,5.71 90 top
R6  1  [R0805']  51.75,23.81 180 top
R7  22.86,13.97 180 top
R8  23.5,18.41 270 top
R9  23.18,26.51 90 top
R10  26.35,23.34 0 top
R11  23.5,22.54 90 top
R12  9.53,34.29 270 top
R13  55.7,11.9 270 top
R14  55.7,8.2 270 top
R15  28.26,35.56 270 top
R16  35.88,36.5 270 top
R17  43.5,35.56 270 top
R18  32.7,36.5 270 top
R19  40.32,35.56 270 top
R20  47.94,35.56 270 top
S1  30.48,42.55 90 top
S2  38.1,42.55 90 top
S3  45.72,42.55 90 top
S4  4.2,31.2 0 top
X1  3.75,9.38 270 top
X2  0.62,18.12 90 top
X3  3.75,46.88 270 top
X4  56.1,32.9 90 top

### Tracks (layer width: path | path; a pad name or v marks a point on that pad's centre or on a via)
AVDD  (via drill 0.3)
  Top 0.305: R6.2 50.64,23.5 v49.53,23.5 48.88,22.84 IC2.27 | C16.2 51.54,20.32 v49.53,20.32 49.01,20.84 IC2.23
  Top 0.61: R6.2 C18.2 | C16.2 C12.2
  Bottom 0.406: v49.53,23.5 v49.53,20.32
BATT_INPUT
  pour Top (no thermals): 6.35,7.4 6.35,13.34 14.76,13.34 14.76,11.75 11.75,11.75 11.75,6.67 7.94,6.67 7.94,3.17 1.91,3.17 1.91,7.4
DEBUG
  Top 0.305: IC2.6 42.57,14.5 42,14 42,11.8 LSP1.MP
GND  (via drill 0.3)
  Top 0.305: 19.84,21.43 19.82,21.43 IC3.9 19.82,25.37 C25.2 19.68,25.72 19.68,27.09 C26.2 | C15.1 49.89,8.89 v51.12,8.89 52.35,8.89 C9.1 | C14.1 v56.52,14.29 | C8.1 v56.52,28.89
  Top 0.406: IC1.4 37.17,6.69 37.15,6.67 | v44.13,2.54 LED1.C | R1.1 v18.41,10.16
  Top 0.61: R20.2 v47.94,33.66 | C31.1 v45.4,33.66 | R19.2 v40.32,33.66 | C30.1 v37.3,33.66 | v30.16,33.66 C29.1 31.17,34.71 31.93,35.37 33.02,35.37 R18.2 | v40.8,30.61 40.8,29.14 C7.1 | C13.1 v44.45,32.5 | C10.1 v46.67,32.5 | C11.1 v48.9,32.5 | 37.47,20.32 C19.1 v37.47,19.37 C17.1 | C20.1 v43.5,10.48 | C21.1 v46.51,10.48 | v53.6,27.2 53.6,25.68 C18.1 | v55,16.19 C6.1 C12.1 C16.1 | S4.1 S4.2 2.87,26.91 v2.92,24.66
  other vias: 36.51,2.54 29.84,3.49 29.84,1.91 27.3,1.91 27.3,3.49 35.24,3.81 35.24,7.62 36.51,7.62 36.51,3.81 27.3,5.08 29.84,5.08 18.41,20.95 22.23,20.95 22.23,19.68 18.41,19.68 13.34,19.37 14.61,19.37 15.88,19.37 25.08,13.97 25.08,15.88 25.08,20.95 25.08,19.68 20.32,12.22 26.67,13.97 16.19,13.18 16.19,12.06 20.32,13.18 29.53,24.13 30.48,24.13 31.43,24.13 43.81,21.59 40.64,21.59 43.81,18.41 46.99,21.59 43.81,24.77
  pour Top (no thermals): 34.61,10.16 34.61,1.27 38.89,1.27 38.89,3.81 37.15,3.81 37.15,7.3 38.73,7.3 38.73,10.16
  pour Top (no thermals): 26.04,5.71 31.11,5.71 31.11,1.27 26.04,1.27
  pour Top (no thermals): 29.21,21.59 18.41,21.59 18.41,22.54 12.7,22.54 12.7,19.05 24.77,19.05 24.77,16.35 23.5,16.35 23.5,12.7 20.64,12.7 20.64,13.65 15.88,13.65 15.88,11.75 26.04,11.75 32.07,17.78 32.07,31.27 29.21,31.27
  pour Bottom: 1.91,48.9 8.89,48.9 8.89,42.55 24.77,42.55 24.77,48.9 49.39,48.7 49.4,42.69 59.69,42.55 59.69,7.3 48.58,7.3 48.58,1.27 24.13,1.27 24.13,6.67 22.54,6.67 21.91,7.3 19.37,7.3 18.73,6.67 7.94,6.67 7.94,3.17 1.91,3.17
MCU_RESET  (via drill 0.3)
  Top 0.305: IC2.20 49.04,19.34 49.2,19.5 50.3,19.5 50.3,16.29 v50.2,16.19
  Top 0.406: v50.2,16.19 C6.2
  Bottom 0.305: X2.8 7.83,13.13 12.06,8.89 29.84,8.89 31.85,8.9 40.74,8.9 41.91,9.53 47.62,9.53 48.26,10.16 48.26,15.24 v50.2,16.19
N$1
  Top 0.305: R8.2 23.5,17.46 23.34,17.14 21.59,17.14 21.32,17.41 IC3.5
N$4  (via drill 0.3)
  Top 0.406: IC1.8 33.31,4.74 33.31,4.63 33.34,4.6 v33.34,3.97 | IC1.5 33.36,6.69 v33.34,7.62 33.34,8.57 | 33.34,8.57 C2.2 | 33.34,8.57 28.57,8.57 C1.+
  Bottom 0.406: v33.34,3.97 v33.34,7.62
  pour Top (no thermals): 19.68,10.16 33.97,10.16 33.97,6.67 22.54,6.67 21.91,7.3 19.37,7.3 18.73,6.67 12.38,6.67 12.38,8.73 18.26,8.73
N$5
  Top 0.406: C3.2 32.7,2.54 32.38,2.86 32.38,5.08 32.7,5.39 IC1.7
N$8  (via drill 0.3)
  Top 0.406: IC1.2 39.2,5.39 v39.49,5.53 | v42.55,6.35 C4.1 R3.1 R4.2
  Bottom 0.406: v39.49,5.53 41.75,5.56 v42.55,6.35
N$9
  Top 0.305: IC1.3 38.9,6.04 39.37,6.51 40.9,6.51 R5.2
N$10
  Top 0.61: X3.3 5.83,39.26 9.53,35.56 R12.1
N$15
  Top 1.27: S3.4 S3.3 47.97,36.44 R20.1
N$19
  Top 0.305: IC3.1 19.32,17.62 17.36,17.62 C24.2
N$20
  Top 0.305: Q1.4 14.31,9.23 14.61,9.53 14.61,9.57 R1.2
N$23
  Top 1.27: S1.4 S1.3 32.77,38.62 R18.1
N$24
  Top 1.27: S2.4 S2.3 40.35,36.44 R19.1
N$26
  Top 0.305: IC3.10 19.32,23.23 18.73,23.81
  Top 0.61: 18.73,23.81 16.49,23.81 D1.C | D1.C 15.06,25.7 14.61,25.88 | C24.1 13.02,17.46 11.75,18.73 11.75,23.18 13.65,25.08 14.45,25.08 14.61,25.24 D1.C
  Top 1.27: 14.61,25.88 14.61,35.56 L1.1
N$27
  Top 0.305: IC3.4 20.82,16.96 21.75,16.03 C23.1
N$28
  Top 0.305: IC3.8 20.32,24.13 21.17,24.98 C25.1 21.27,25.61 21.27,25.56 21.49,25.66 R9.1
N$29
  Top 0.406: R2.2 47.62,2.6 LED1.A
N$30
  Top 0.305: IC2.40 44.06,26.58 42.9,27.74 C7.2
N$31
  Top 0.305: 20.8,27.62 C26.1 23.12,27.3 R9.2
N$32
  Top 0.305: IC3.7 20.82,23.52 21.11,23.81 23.97,23.81 25.08,23.81 25.08,23.44 R10.1
  Top 0.406: R11.2 23.97,23.39 23.97,23.81
N$71
  Top 0.305: IC3.2 19.82,17.28 19.37,16.83
  Top 0.61: 19.37,16.83 19.37,15.08 19.21,14.92 18.6,14.92 C22.1 18.44,15.37 18.41,15.4 14.04,15.4 F1.P$2
PA0_S1_KEY_INC  (via drill 0.3)
  Top 0.305: v38.5,31.65 35,28.21 35,16.26 36.58,14.9 38.73,14.92 40.06,16.25 IC2.1 | v30.97,38.18 30.97,38.14 30.96,36.35 30.22,36.35 C29.2
  Top 0.61: C29.2 30.11,36.35 28.26,36.35 R15.1 | LSP2.MP 28.23,48.6 S1.2
  Top 1.27: S1.2 S1.1 28.23,36.44 R15.1
  Bottom 0.305: v38.5,31.65 38.5,38.18 v30.97,38.18
PA1_S2_KEY_DEC
  Top 0.305: R16.1 37.78,37.35 37.78,36.51 38.9,36.54 38.9,33.18 38.42,32.7 36.94,31.2 34,28.37 34,16.24 36.46,14.19 38.95,14.19 40.56,15.8 IC2.2
  Top 0.61: LSP3.MP 35.85,48.6 S2.2 | R16.1 37.84,37.35 C30.2
  Top 1.27: S2.2 S2.1 35.81,38.62 R16.1
PA2_S3_KEY_MODE  (via drill 0.3)
  Top 0.305: IC2.3 41.06,15.37 40,14.3 v40,13.3 | v45.4,38 C31.2
  Top 0.61: R17.1 C31.2 | LSP4.MP 43.47,48.6 S3.2
  Top 1.27: S3.2 S3.1 43.47,36.44 R17.1
  Bottom 0.305: v40,13.3 40.2,13.3 41.1,12.4 45.5,12.4 46.6,13.5 46.6,19.5 46,20.1 46,23.9 49.9,28.5 49.9,38 v45.4,38
PA3_SERVO_ENABLE  (via drill 0.3)
  Top 0.305: IC3.3 20.32,14.61 v20.64,14.29 21.91,14.29 | 21.91,14.29 22.23,13.97 R7.2 | 22.07,14.29 21.91,14.29 | IC2.4 41.57,17.11 v41.57,14.61
  Top 0.406: 22.23,13.97 22.07,14.13 22.07,14.29
  Bottom 0.305: v20.64,14.29 22.54,12.38 29.53,12.38 31.11,15 31.61,15.7 34.6,15.8 36.4,14.6 v41.57,14.61
PA8_I2C0_PULLUP
  Top 0.305: IC2.17 48.86,17.84 49.1,17.6 49.1,15.9 49.7,15.1 53.6,15.1 53.6,11.6 54.1,11.1 55.65,11.1 R13.2
PA9_I2CO_PULLUP  (via drill 0.3)
  Top 0.305: IC2.18 48.94,18.34 v49.6,18.7 | v53.9,8.6 53.9,7.6 54.1,7.4 55.65,7.4 R14.2
  Bottom 0.305: v49.6,18.7 52.7,18.7 53.4,18 53.4,9.1 v53.9,8.6
PB7_LFXTAL_P
  Top 0.305: IC2.15 47.06,16.12 49.53,13.65 49.53,13.36 Q3.2 49.87,10.85 C15.2
PB8_LFXTAL_N
  Top 0.305: IC2.16 47.56,16.57 49.53,14.51 51.28,14.51 52.07,13.81 52.07,13.31 Q3.1 52.37,10.85 C9.2
PB13_HFXTAL_P
  Top 0.305: IC2.24 54.54,21.34 56.19,19.69 Q2.2 C14.2
PB14_HFXTAL_N
  Top 0.305: IC2.25 54.54,21.84 56.19,23.49 Q2.1 C8.2
PC0_POWER_LED
  Top 0.305: R2.1 47.62,14.61 46.35,15.88 44.45,15.88 44.06,16.26 IC2.9
PC6_TRIG_POS_2  (via drill 0.3)
  Top 0.305: IC2.37 45.56,26.77 46.4,27.6 52.9,27.6 v54.8,29.8 | R13.1 57.05,12.75 v57.9,13.6
  Bottom 0.305: X4.1 54.8,31.6 v54.8,29.8 57.9,29.8 v57.9,13.6
PC7_TRIG_POS_1
  Top 0.305: X4.2 56.59,36.71 58.7,34.6 58.7,30.5 | 58.7,30.5 58.7,9.8 58,9.1 55.75,9.1 R14.1 | IC2.38 45.06,28.07 45.3,28.3 52.2,28.3 54.2,30.5 58.7,30.5
PC9_PULS_SERVO  (via drill 0.3)
  Top 0.305: v47.09,26.91 47.06,26.83 IC2.34 | v9.53,31.75 R12.2 | IC2.42 43.06,26.1 43.04,26.69 41.83,27.5 v41.8,27.5
  Bottom 0.305: v9.53,31.75 9.53,29.3 37.47,29.3 40.08,26.87 41.6,26.87 | 41.6,26.87 45.85,26.87 v47.09,26.91 | v41.8,27.5 41.8,27.07 41.6,26.87
PD3_I2C_CONFIG  (via drill 0.3)
  Top 0.305: S4.4 2.93,35.83 v4.5,37.4 | v49.5,24.8 49.62,24.8 IC2.31
  Bottom 0.305: v4.5,37.4 25.5,37.4 28.5,40.5 51.7,40.5 51.7,25 49.8,25 v49.5,24.8
PD4_I2C_CONFIG  (via drill 0.3)
  Top 0.305: 7.5,35.5 v7.6,35.4 | IC2.32 48.83,25.34 49.2,26.35 v49.35,26.18
  Top 0.406: S4.3 7.6,35.5 v7.6,35.4
  Bottom 0.305: v7.6,35.4 25.4,35.4 29.6,39.6 50.7,39.6 50.8,39.2 50.8,27.79 v49.35,26.18
PF0_DBG_SWCLK  (via drill 0.3)
  Top 0.305: v37.41,27.79 39.37,26.04 IC2.49
  Bottom 0.305: X2.4 6.91,19.12 6.35,19.68 6.35,25.4 8.68,28.33 37.18,28.33 v37.41,27.79
PF1_DBG_SWDIO  (via drill 0.3)
  Top 0.305: IC2.50 38.66,24.84 v37.47,26.04
  Bottom 0.305: X2.2 7.83,25.61 9.39,27.38 34.42,27.38 36.1,26 37.43,26 v37.47,26.04
PF2_DBG_SWO  (via drill 0.3)
  Top 0.305: X2.6 6.37,17.12 5.71,17.78 5.71,22.86 6.99,24.13 v8.89,24.13 | v37.47,24.77 37.89,24.34 IC2.51
  Bottom 0.305: v8.89,24.13 8.89,25.4 9.81,26.42 33.47,26.42 35.73,24.77 v37.47,24.77
UA1
  Top 0.406: C28.1 27.15,29.84
  Top 0.61: 27.15,26.7 C27.1 27.18,26.54 27.15,26.51 27.15,23.39 R10.2 | C28.1 27.18,30.61 | 24.13,33.66 24.13,35.45 L1.2
  Top 0.813: F2.P$1 16.74,39.77 18.41,38.1 18.41,31.75 20.32,29.84 C28.1
  Top 1.27: 27.15,29.84 27.15,26.7 | 27.18,30.61 24.13,33.66
VDD_SERVO
  Top 0.813: X3.2 4.04,42.77 F2.P$2
VMCU  (via drill 0.3)
  Top 0.305: IC2.55 37.82,22.34 C19.2 | C13.2 44.56,28.85 IC2.39 44.56,28.89 44.45,29.4 | IC2.8 43.56,13.54 C20.2 | IC2.26 51.23,22.34 52.23,23.34 52.7,23.77 R6.1 | R16.2 35.85,35.72 36.02,35.74 | 34.39,36.18 v34.4,44
  Top 0.406: IC1.1 40.52,4.74 R5.1 | C5.2 40.96,2.54 | 45.09,8.79 R3.2 | C4.2 45.09,6.35 | R15.2 26.2,34.71 v26.17,44 | 34.3,44 34.35,35.58 35.94,35.58 | v42,44 42,35 43.21,35 R17.2
  Top 0.61: R5.1 40.96,2.54 | C5.2 42.23,2.54 45.09,5.4 45.09,6.35 45.09,8.79 | 37.47,22.54 C19.2 | 44.43,29.39 42.55,30.48 42.55,31.78 | 44.43,29.39 44.45,29.4 47.11,29.4 | C10.2 47.11,29.4 | 44.43,29.39 44.57,29.25 C13.2 | 47.11,29.4 49.08,29.4 C11.2 48.93,29.35 50.57,29.35 51.62,30.4 v52.66,30.4 | 37.82,22.34 37.67,22.34 37.47,22.54 | 37.47,22.54 v36.1,22.54 36.1,28.04 40.16,31.78 42.55,31.78 | v36.1,16.19 37.34,16.19 C17.2 | R3.2 45.14,8.99 45.09,9.05 v45.09,13.65 43.81,13.65 C20.2 C21.2 | v54.63,27.62 54.63,24.45 53.5,23.81 R6.1 | 42.55,31.78 42.55,34.29 42.97,34.71 R17.2 | 35.94,35.58 R16.2 | v34.4,44 34.3,44
  Bottom 0.305: X2.1 9.84,21.11 10.14,21.41 10.14,25.38 11.33,25.37 31.97,25.37 v36.1,22.54
  Bottom 0.406: v26.17,44 v34.4,44 v42,44
  Bottom 0.61: v36.1,22.54 v36.1,16.19 42.55,16.19 v45.09,13.65 | v52.66,30.4 v54.63,27.62

### Text on the board
Top: BS | PL12102016
Bottom: PL12102016 | LS
tPlace: SERVO_2016
tNames: GND_SERVO | VDD_SERVO | GND | PULS_ / SERVO | S2 | S1 | SWDIO | SWCLK | GND | SWO | RESET | GND | BATT_INPUT